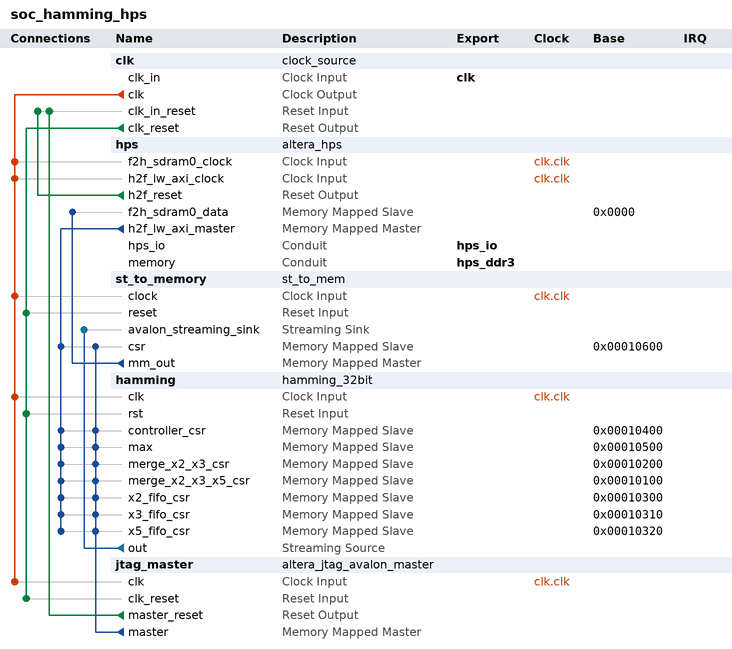
[diagram p0: system contents]
# Platform Designer (Qsys) system soc_hamming_hps, Cyclone V 5CSXFC6C6U23C8ES
# Parameters at their usual value, and those the tool derives, are not listed.
package require -exact qsys 13.1
create_system soc_hamming_hps
set_project_property DEVICE_FAMILY {Cyclone V}
set_project_property DEVICE 5CSXFC6C6U23C8ES

add_instance clk clock_source 13.1
set_instance_parameter_value clk clockFrequency 100000000

add_instance hps altera_hps 13.1
set_instance_parameter_value hps MEM_VENDOR Micron
set_instance_parameter_value hps MEM_ROW_ADDR_WIDTH 15
set_instance_parameter_value hps MEM_COL_ADDR_WIDTH 10
set_instance_parameter_value hps MEM_DQ_WIDTH 32
set_instance_parameter_value hps MEM_BANKADDR_WIDTH 3
set_instance_parameter_value hps MEM_DRV_STR RZQ/6
set_instance_parameter_value hps MEM_RTT_NOM RZQ/4
set_instance_parameter_value hps MEM_RTT_WR {Dynamic ODT off}
set_instance_parameter_value hps MEM_WTCL 6
set_instance_parameter_value hps MEM_TCL 7
set_instance_parameter_value hps TIMING_TIS 170
set_instance_parameter_value hps TIMING_TIH 120
set_instance_parameter_value hps TIMING_TDS 10
set_instance_parameter_value hps TIMING_TDH 45
set_instance_parameter_value hps TIMING_TDQSQ 100
set_instance_parameter_value hps TIMING_TDQSCK 255
set_instance_parameter_value hps TIMING_TDQSS 0.27
set_instance_parameter_value hps TIMING_TQSH 0.45
set_instance_parameter_value hps TIMING_TDSH 0.18
set_instance_parameter_value hps TIMING_TDSS 0.18
set_instance_parameter_value hps MEM_TRAS_NS 35.0
set_instance_parameter_value hps MEM_TRCD_NS 13.75
set_instance_parameter_value hps MEM_TRP_NS 13.75
set_instance_parameter_value hps MEM_TRFC_NS 260.0
set_instance_parameter_value hps MEM_TFAW_NS 30.0
set_instance_parameter_value hps MEM_TRRD_NS 10.0
set_instance_parameter_value hps MEM_TRTP_NS 10.0
set_instance_parameter_value hps REF_CLK_FREQ 25.0
set_instance_parameter_value hps DEFAULT_FAST_SIM_MODEL true
set_instance_parameter_value hps TIMING_BOARD_MAX_CK_DELAY 0.6
set_instance_parameter_value hps TIMING_BOARD_MAX_DQS_DELAY 0.6
set_instance_parameter_value hps TIMING_BOARD_SKEW_CKDQS_DIMM_MIN -0.01
set_instance_parameter_value hps TIMING_BOARD_SKEW_CKDQS_DIMM_MAX 0.01
set_instance_parameter_value hps TIMING_BOARD_SKEW_WITHIN_DQS 0.02
set_instance_parameter_value hps TIMING_BOARD_SKEW_BETWEEN_DQS 0.02
set_instance_parameter_value hps TIMING_BOARD_DQ_TO_DQS_SKEW 0.0
set_instance_parameter_value hps TIMING_BOARD_AC_SKEW 0.02
set_instance_parameter_value hps TIMING_BOARD_AC_TO_CK_SKEW 0.0
set_instance_parameter_value hps MEM_CLK_FREQ 400.0
set_instance_parameter_value hps HPS_PROTOCOL DDR3
set_instance_parameter_value hps STM_Enable false
set_instance_parameter_value hps F2S_Width 0
set_instance_parameter_value hps S2F_Width 0
set_instance_parameter_value hps LWH2F_Enable true
set_instance_parameter_value hps F2SDRAM_Type {Avalon-MM Write-Only}
set_instance_parameter_value hps F2SDRAM_Width 256
set_instance_parameter_value hps F2SCLK_DBGRST_Enable false
set_instance_parameter_value hps F2SCLK_WARMRST_Enable false
set_instance_parameter_value hps F2SCLK_COLDRST_Enable false
set_instance_parameter_value hps F2SINTERRUPT_Enable false
set_instance_parameter_value hps EMAC1_PinMuxing {HPS I/O Set 0}
set_instance_parameter_value hps EMAC1_Mode RGMII
set_instance_parameter_value hps QSPI_PinMuxing Unused
set_instance_parameter_value hps QSPI_Mode N/A
set_instance_parameter_value hps SDIO_PinMuxing {HPS I/O Set 0}
set_instance_parameter_value hps SDIO_Mode {4-bit Data}
set_instance_parameter_value hps USB1_PinMuxing Unused
set_instance_parameter_value hps USB1_Mode N/A
set_instance_parameter_value hps SPIM1_PinMuxing Unused
set_instance_parameter_value hps SPIM1_Mode N/A
set_instance_parameter_value hps UART0_PinMuxing {HPS I/O Set 1}
set_instance_parameter_value hps UART0_Mode {No Flow Control}
set_instance_parameter_value hps I2C0_PinMuxing Unused
set_instance_parameter_value hps I2C0_Mode N/A
set_instance_parameter_value hps I2C1_PinMuxing Unused
set_instance_parameter_value hps I2C1_Mode N/A
set_instance_parameter_value hps S2FCLK_USER1CLK_FREQ 100
set_instance_parameter_value hps FPGA_PERIPHERAL_OUTPUT_CLOCK_FREQ_EMAC0_MD_CLK 100
set_instance_parameter_value hps FPGA_PERIPHERAL_OUTPUT_CLOCK_FREQ_EMAC0_GTX_CLK 100
set_instance_parameter_value hps FPGA_PERIPHERAL_OUTPUT_CLOCK_FREQ_EMAC1_MD_CLK 100
set_instance_parameter_value hps FPGA_PERIPHERAL_OUTPUT_CLOCK_FREQ_EMAC1_GTX_CLK 100

add_instance st_to_memory st_to_mem 1.0
set_instance_parameter_value st_to_memory IN_WIDTH 32
set_instance_parameter_value st_to_memory WRITE_WIDTH 256
set_instance_parameter_value st_to_memory ADDRESS_WIDTH 32
set_instance_parameter_value st_to_memory COUNT_WIDTH 3

add_instance hamming hamming_32bit 1.0

add_instance jtag_master altera_jtag_avalon_master 13.1

# connections
add_connection clk.clk hamming.clk clock
add_connection clk.clk hps.f2h_sdram0_clock clock
add_connection clk.clk hps.h2f_lw_axi_clock clock
add_connection clk.clk jtag_master.clk clock
add_connection clk.clk st_to_memory.clock clock
add_connection clk.clk_reset hamming.rst reset
add_connection clk.clk_reset jtag_master.clk_reset reset
add_connection clk.clk_reset st_to_memory.reset reset
add_connection hps.h2f_reset clk.clk_in_reset reset
add_connection jtag_master.master_reset clk.clk_in_reset reset
add_connection hps.h2f_lw_axi_master hamming.controller_csr avalon
set_connection_parameter_value hps.h2f_lw_axi_master/hamming.controller_csr baseAddress 0x00010400
add_connection hps.h2f_lw_axi_master hamming.max avalon
set_connection_parameter_value hps.h2f_lw_axi_master/hamming.max baseAddress 0x00010500
add_connection hps.h2f_lw_axi_master hamming.merge_x2_x3_csr avalon
set_connection_parameter_value hps.h2f_lw_axi_master/hamming.merge_x2_x3_csr baseAddress 0x00010200
add_connection hps.h2f_lw_axi_master hamming.merge_x2_x3_x5_csr avalon
set_connection_parameter_value hps.h2f_lw_axi_master/hamming.merge_x2_x3_x5_csr baseAddress 0x00010100
add_connection hps.h2f_lw_axi_master hamming.x2_fifo_csr avalon
set_connection_parameter_value hps.h2f_lw_axi_master/hamming.x2_fifo_csr baseAddress 0x00010300
add_connection hps.h2f_lw_axi_master hamming.x3_fifo_csr avalon
set_connection_parameter_value hps.h2f_lw_axi_master/hamming.x3_fifo_csr baseAddress 0x00010310
add_connection hps.h2f_lw_axi_master hamming.x5_fifo_csr avalon
set_connection_parameter_value hps.h2f_lw_axi_master/hamming.x5_fifo_csr baseAddress 0x00010320
add_connection hps.h2f_lw_axi_master st_to_memory.csr avalon
set_connection_parameter_value hps.h2f_lw_axi_master/st_to_memory.csr baseAddress 0x00010600
add_connection jtag_master.master hamming.controller_csr avalon
set_connection_parameter_value jtag_master.master/hamming.controller_csr baseAddress 0x00010400
add_connection jtag_master.master hamming.max avalon
set_connection_parameter_value jtag_master.master/hamming.max baseAddress 0x00010500
add_connection jtag_master.master hamming.merge_x2_x3_csr avalon
set_connection_parameter_value jtag_master.master/hamming.merge_x2_x3_csr baseAddress 0x00010200
add_connection jtag_master.master hamming.merge_x2_x3_x5_csr avalon
set_connection_parameter_value jtag_master.master/hamming.merge_x2_x3_x5_csr baseAddress 0x00010100
add_connection jtag_master.master hamming.x2_fifo_csr avalon
set_connection_parameter_value jtag_master.master/hamming.x2_fifo_csr baseAddress 0x00010300
add_connection jtag_master.master hamming.x3_fifo_csr avalon
set_connection_parameter_value jtag_master.master/hamming.x3_fifo_csr baseAddress 0x00010310
add_connection jtag_master.master hamming.x5_fifo_csr avalon
set_connection_parameter_value jtag_master.master/hamming.x5_fifo_csr baseAddress 0x00010320
add_connection jtag_master.master st_to_memory.csr avalon
set_connection_parameter_value jtag_master.master/st_to_memory.csr baseAddress 0x00010600
add_connection st_to_memory.mm_out hps.f2h_sdram0_data avalon
set_connection_parameter_value st_to_memory.mm_out/hps.f2h_sdram0_data baseAddress 0x0000
add_connection hamming.out st_to_memory.avalon_streaming_sink avalon_streaming

# exported interfaces
add_interface clk clock sink
set_interface_property clk EXPORT_OF clk.clk_in
add_interface hps_io conduit end
set_interface_property hps_io EXPORT_OF hps.hps_io
add_interface hps_ddr3 conduit end
set_interface_property hps_ddr3 EXPORT_OF hps.memory

set_interconnect_requirement {$system} qsys_mm.clockCrossingAdapter HANDSHAKE
set_interconnect_requirement {$system} qsys_mm.maxAdditionalLatency 1
set_interconnect_requirement {$system} qsys_mm.insertDefaultSlave false

save_system soc_hamming_hps.qsys
